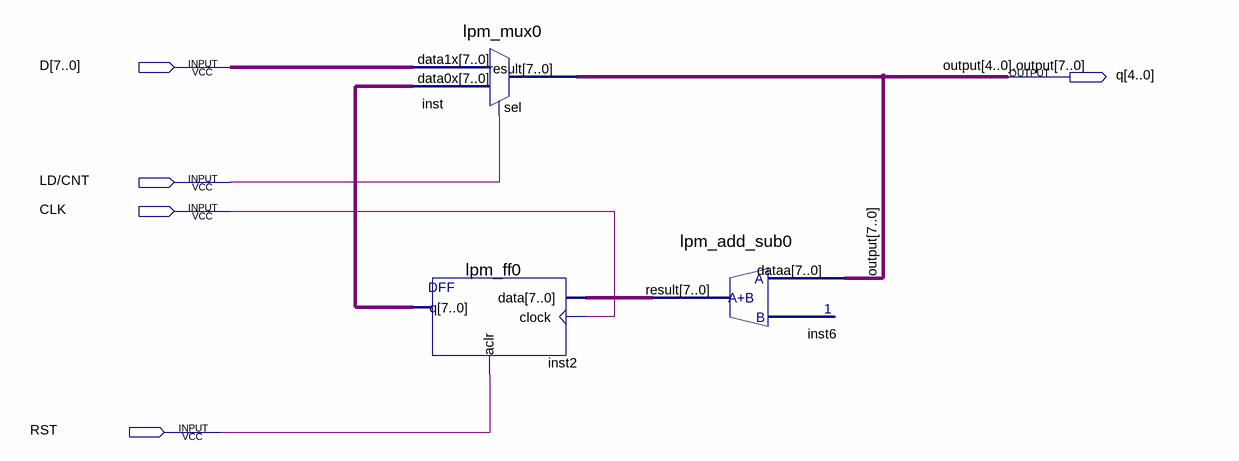
[diagram p0: schematic sheet]
// Quartus schematic HC11_PC.bdf as structural Verilog: 3 symbols, 5 pins
module HC11_PC (
  input  [7:0] D,
  input  \LD/CNT ,
  input  CLK,
  input  RST,
  output [4:0] q
);

  wire [7:0] inst2_q, inst6_result, \output ;

  lpm_mux0 inst (.data1x(D), .data0x(inst2_q), .sel(\LD/CNT ), .result({\output [4:0], \output }));
  lpm_ff0 inst2 (.data(inst6_result), .clock(CLK), .aclr(RST), .q(inst2_q));
  lpm_add_sub0 inst6 (.dataa(\output ), .result(inst6_result));
endmodule
